# Altium schematic sheet Sensors.SchDoc
size A
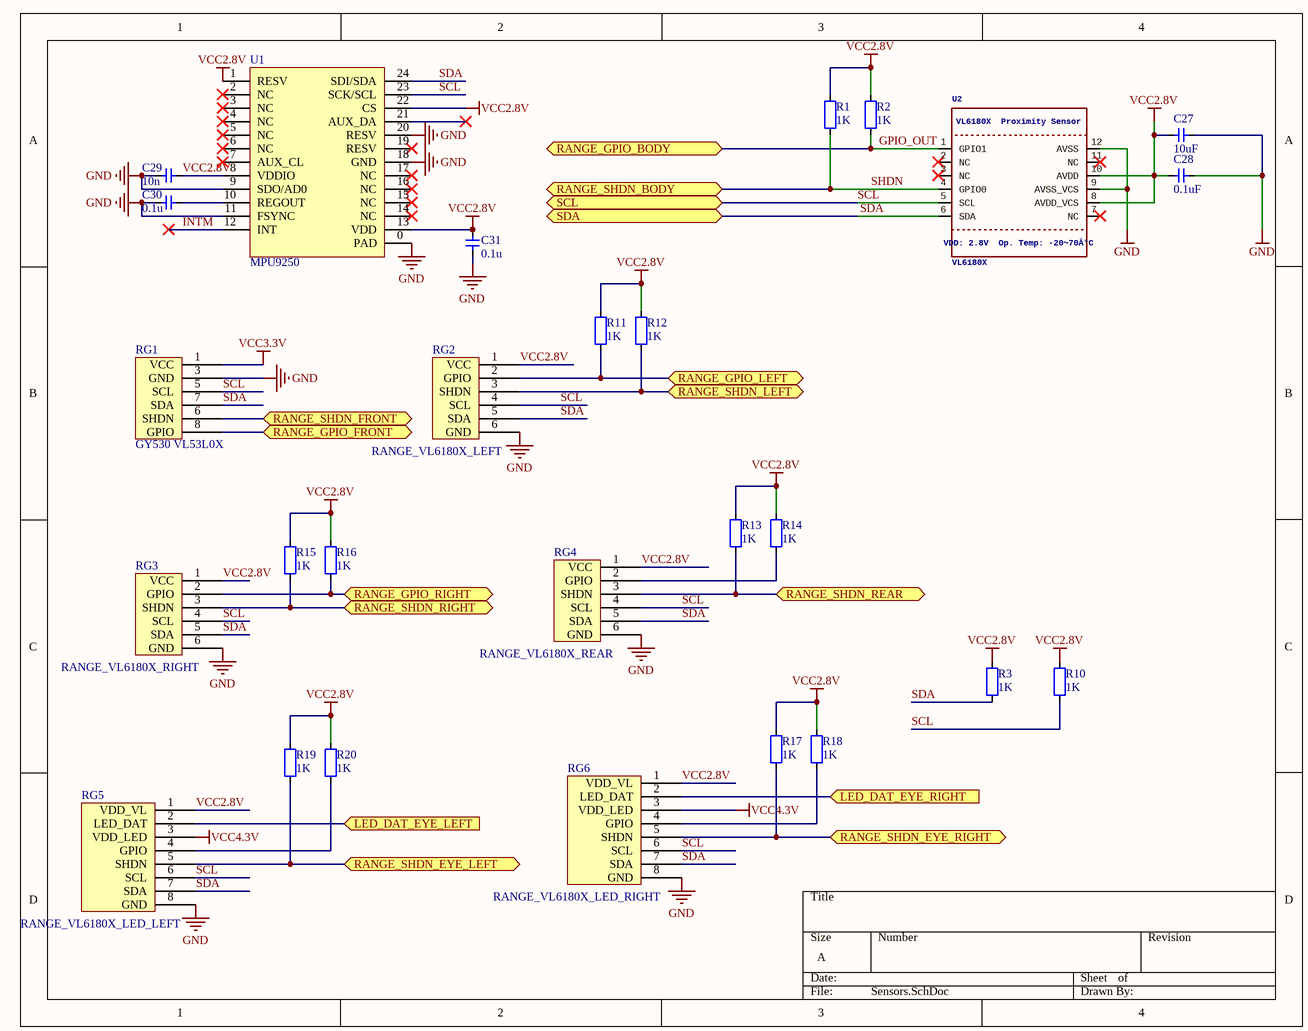
[diagram p0: Sensors.SchDoc]

## Parts
C27  value 10uF  [CAP_0805]  (hidden comment: Cap_0805)
C28  value 0.1uF  [CAP_0603]  (hidden comment: Cap_0603)
C29  value 10n  [CAP_0402]  (hidden comment: Cap_0402)
C30  value 0.1u  [CAP_0402]  (hidden comment: Cap_0402)
C31  value 0.1u  [CAP_0402]  (hidden comment: Cap_0402)
R1  value 1K  [RES_0603]  (hidden comment: Res_0603)
R2  value 1K  [RES_0603]  (hidden comment: Res_0603)
R3  value 1K  [RES_0603]  (hidden comment: Res_0603)
R10  value 1K  [RES_0603]  (hidden comment: Res_0603)
R11  value 1K  [RES_0603]  (hidden comment: Res_0603)
R12  value 1K  [RES_0603]  (hidden comment: Res_0603)
R13  value 1K  [RES_0603]  (hidden comment: Res_0603)
R14  value 1K  [RES_0603]  (hidden comment: Res_0603)
R15  value 1K  [RES_0603]  (hidden comment: Res_0603)
R16  value 1K  [RES_0603]  (hidden comment: Res_0603)
R17  value 1K  [RES_0603]  (hidden comment: Res_0603)
R18  value 1K  [RES_0603]  (hidden comment: Res_0603)
R19  value 1K  [RES_0603]  (hidden comment: Res_0603)
R20  value 1K  [RES_0603]  (hidden comment: Res_0603)
RG1  GY530 VL53L0X  [HDR2X4_2.54_180]
RG2  RANGE_VL6180X_LEFT  [HDR1X6_1.27_180H_SMD]
RG3  RANGE_VL6180X_RIGHT  [HDR1X6_1.27_180H_SMD]
RG4  RANGE_VL6180X_REAR  [HDR1X6_1.27_180]
RG5  RANGE_VL6180X_LED_LEFT  [HDR1X8_1.27_180]
RG6  RANGE_VL6180X_LED_RIGHT  [HDR1X8_1.27_180]
U1  MPU9250  [QFN_P0.4_24]
U2  VL6180X  VL6180X
ProximitySensor: VL6180X / Proximity Sensor  VDD:2.8V
Op.Temp:-20~70Â°C: VDD: 2.8V / Op. Temp: -20~70Â°C  [LGA12_ST_4.8X2.8X1MM]

## Ports
LED_DAT_EYE_LEFT (in), LED_DAT_EYE_RIGHT (in), RANGE_GPIO_BODY, RANGE_GPIO_FRONT, RANGE_GPIO_LEFT, RANGE_GPIO_RIGHT, RANGE_SHDN_BODY, RANGE_SHDN_EYE_LEFT, RANGE_SHDN_EYE_RIGHT, RANGE_SHDN_FRONT, RANGE_SHDN_LEFT, RANGE_SHDN_REAR, RANGE_SHDN_RIGHT, SCL, SDA

## Nets
GND: C27.1 C28.1 C29.1 C30.1 C31.1 RG1.3(GND) RG2.6(GND) RG3.6(GND) RG4.6(GND) RG5.8(GND) RG6.8(GND) U1.0(PAD) U1.9(SDO/AD0) U1.11(FSYNC) U1.18(GND) U1.20(RESV) U2.9(AVSS_VCS) U2.12(AVSS)
VCC2.8V: C27.2 C28.2 C29.2 C31.2 R1.2 R2.2 R3.2 R10.2 R11.2 R12.2 R13.2 R14.2 R15.2 R16.2 R17.2 R18.2 R19.2 R20.2 RG2.1(VCC) RG3.1(VCC) RG4.1(VCC) RG5.1(VDD_VL) RG6.1(VDD_VL) U1.1(RESV) U1.8(VDDIO) U1.13(VDD) U1.22(CS) U2.8(AVDD_VCS) U2.10(AVDD)
VCC3.3V: RG1.1(VCC)
VCC4.3V: RG5.3(VDD_LED) RG6.3(VDD_LED)
GPIO_OUT: R2.1 U2.1(GPIO1) ; port RANGE_GPIO_BODY
INTM: U1.12(INT)
LED_DAT_EYE_LEFT: RG5.2(LED_DAT) ; port LED_DAT_EYE_LEFT
LED_DAT_EYE_RIGHT: RG6.2(LED_DAT) ; port LED_DAT_EYE_RIGHT
RANGE_GPIO_FRONT: RG1.8(GPIO) ; port RANGE_GPIO_FRONT
RANGE_GPIO_LEFT: R11.1 RG2.2(GPIO) ; port RANGE_GPIO_LEFT
RANGE_GPIO_RIGHT: R16.1 RG3.2(GPIO) ; port RANGE_GPIO_RIGHT
RANGE_SHDN_EYE_LEFT: R19.1 RG5.5(SHDN) ; port RANGE_SHDN_EYE_LEFT
RANGE_SHDN_EYE_RIGHT: R17.1 RG6.5(SHDN) ; port RANGE_SHDN_EYE_RIGHT
RANGE_SHDN_FRONT: RG1.6(SHDN) ; port RANGE_SHDN_FRONT
RANGE_SHDN_LEFT: R12.1 RG2.3(SHDN) ; port RANGE_SHDN_LEFT
RANGE_SHDN_REAR: R13.1 RG4.3(SHDN) ; port RANGE_SHDN_REAR
RANGE_SHDN_RIGHT: R15.1 RG3.3(SHDN) ; port RANGE_SHDN_RIGHT
SCL: R10.1 RG1.5(SCL) RG2.4(SCL) RG3.4(SCL) RG4.4(SCL) RG5.6(SCL) RG6.6(SCL) U1.23(SCK/SCL) U2.5(SCL) ; port SCL
SDA: R3.1 RG1.7(SDA) RG2.5(SDA) RG3.5(SDA) RG4.5(SDA) RG5.7(SDA) RG6.7(SDA) U1.24(SDI/SDA) U2.6(SDA) ; port SDA
SHDN: R1.1 U2.4(GPIO0) ; port RANGE_SHDN_BODY
NetC30_2: C30.2 U1.10(REGOUT)
NetR14_1: R14.1 RG4.2(GPIO)
NetR18_1: R18.1 RG6.4(GPIO)
NetR20_1: R20.1 RG5.4(GPIO)

Not connected (* = marked no-connect by the designer): U1 2(NC)* 3(NC)* 4(NC)* 5(NC)* 6(NC)* 7(AUX_CL)* 14(NC)* 15(NC)* 16(NC)* 17(NC)* 19(RESV)* 21(AUX_DA)*; U2 2(NC)* 3(NC)* 7(NC)* 11(NC)*

## Library data of the parts
C27 = Cap_0805: Capacitor
C28 = Cap_0603: Capacitor
C29-C31 = Cap_0402: Capacitor
R1-R3 R10-R20 = Res_0603: Resistor
RG1 = GY530-VL53L0X: For font range detection VL53L0X
RG2-RG4 = RANGE_VL6180X
RG5 RG6 = RANGE_VL6180X_LED
U1 = MPU925x: Sensor Motion
U2 = VL6180X: VL6180x Proximity and Light Sensor with Gesture Recognition    Supply Level: 2.8V (3.0V Max!)  Range: 0-10cm  Light Sensor: 0..100K Lux (16-bit output)  IR emitter: 850 nm  I2C Address: 0x29 (7-bit)